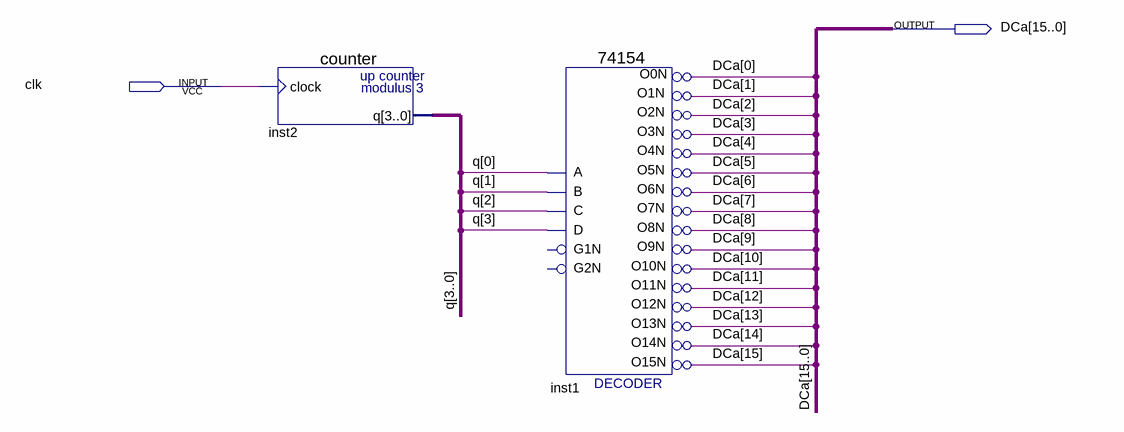
[diagram p0: schematic sheet]
// Quartus schematic DCa.bdf as structural Verilog: 2 symbols, 2 pins
module DCa (
  input  clk,
  output [15:0] DCa
);

  wire inst1_o0n, inst1_o1n, inst1_o2n, inst1_o3n, inst1_o4n, inst1_o5n, inst1_o6n, inst1_o7n, inst1_o8n,
       inst1_o9n, inst1_o10n, inst1_o11n, inst1_o12n, inst1_o13n, inst1_o14n, inst1_o15n;
  wire [3:0] q;

  counter inst2 (.clock(clk), .q(q));
  \74154  inst1 (
    .C(q[2]), .D(q[3]), .B(q[1]), .A(q[0]), .O0N(inst1_o0n), .O12N(inst1_o12n), .O15N(inst1_o15n),
    .O10N(inst1_o10n), .O11N(inst1_o11n), .O1N(inst1_o1n), .O13N(inst1_o13n), .O14N(inst1_o14n),
    .O4N(inst1_o4n), .O3N(inst1_o3n), .O2N(inst1_o2n), .O7N(inst1_o7n), .O6N(inst1_o6n), .O5N(inst1_o5n),
    .O9N(inst1_o9n), .O8N(inst1_o8n));  // open: G1N, G2N
  not inst1_O0N_inverted (DCa[0], inst1_o0n);
  not inst1_O12N_inverted (DCa[12], inst1_o12n);
  not inst1_O15N_inverted (DCa[15], inst1_o15n);
  not inst1_O10N_inverted (DCa[10], inst1_o10n);
  not inst1_O11N_inverted (DCa[11], inst1_o11n);
  not inst1_O1N_inverted (DCa[1], inst1_o1n);
  not inst1_O13N_inverted (DCa[13], inst1_o13n);
  not inst1_O14N_inverted (DCa[14], inst1_o14n);
  not inst1_O4N_inverted (DCa[4], inst1_o4n);
  not inst1_O3N_inverted (DCa[3], inst1_o3n);
  not inst1_O2N_inverted (DCa[2], inst1_o2n);
  not inst1_O7N_inverted (DCa[7], inst1_o7n);
  not inst1_O6N_inverted (DCa[6], inst1_o6n);
  not inst1_O5N_inverted (DCa[5], inst1_o5n);
  not inst1_O9N_inverted (DCa[9], inst1_o9n);
  not inst1_O8N_inverted (DCa[8], inst1_o8n);
endmodule
